# Altium schematic sheet LMS7002M Power.SchDoc
size E
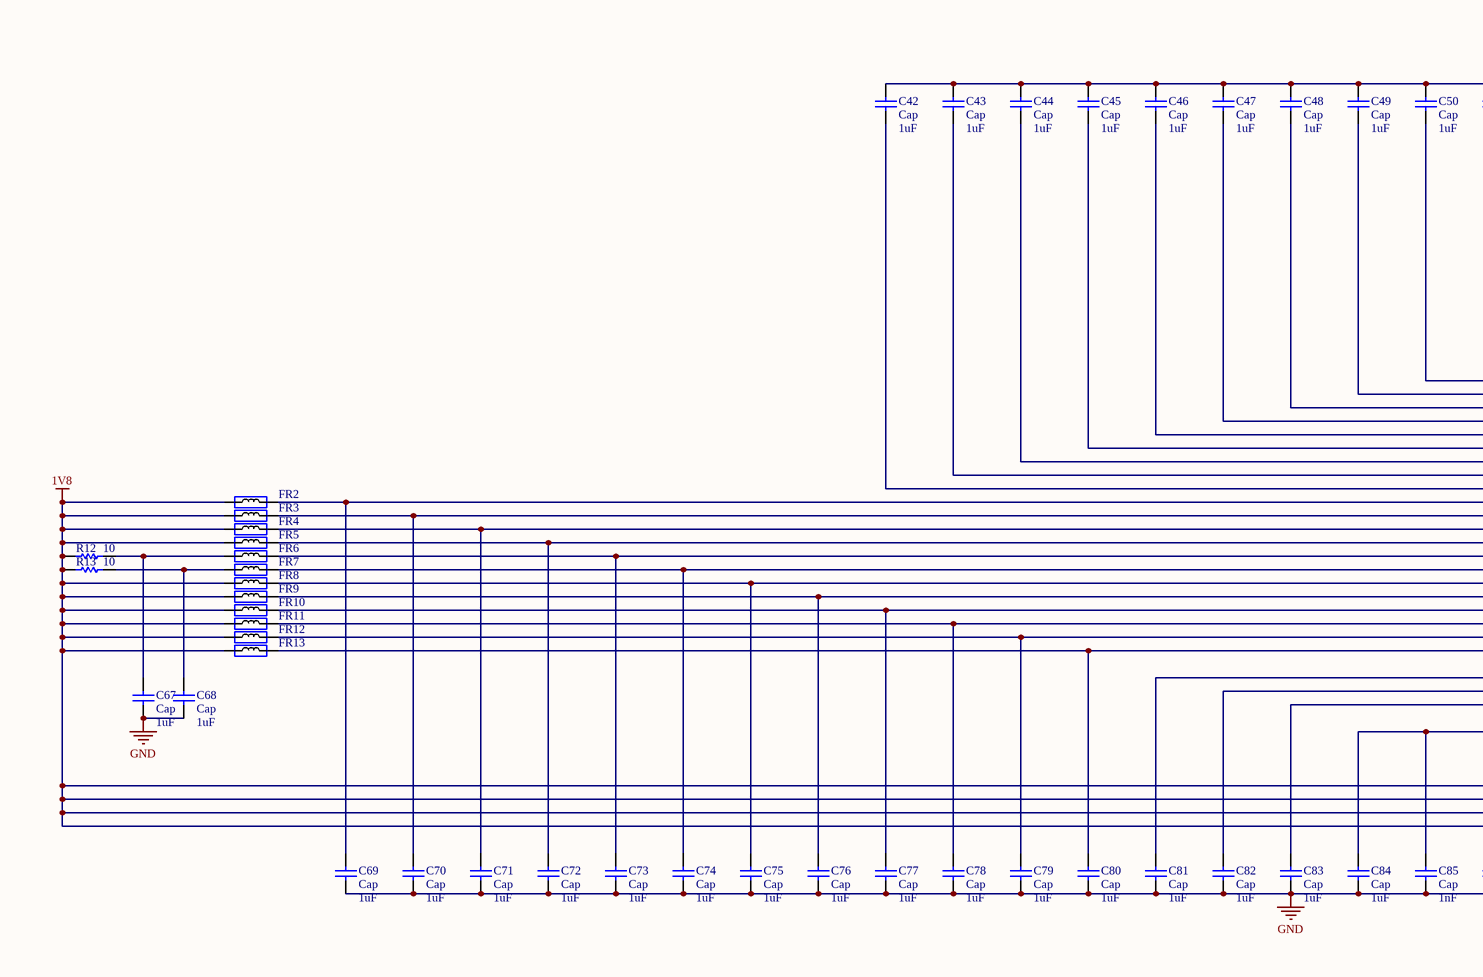
[diagram p0: LMS7002M Power.SchDoc, left]
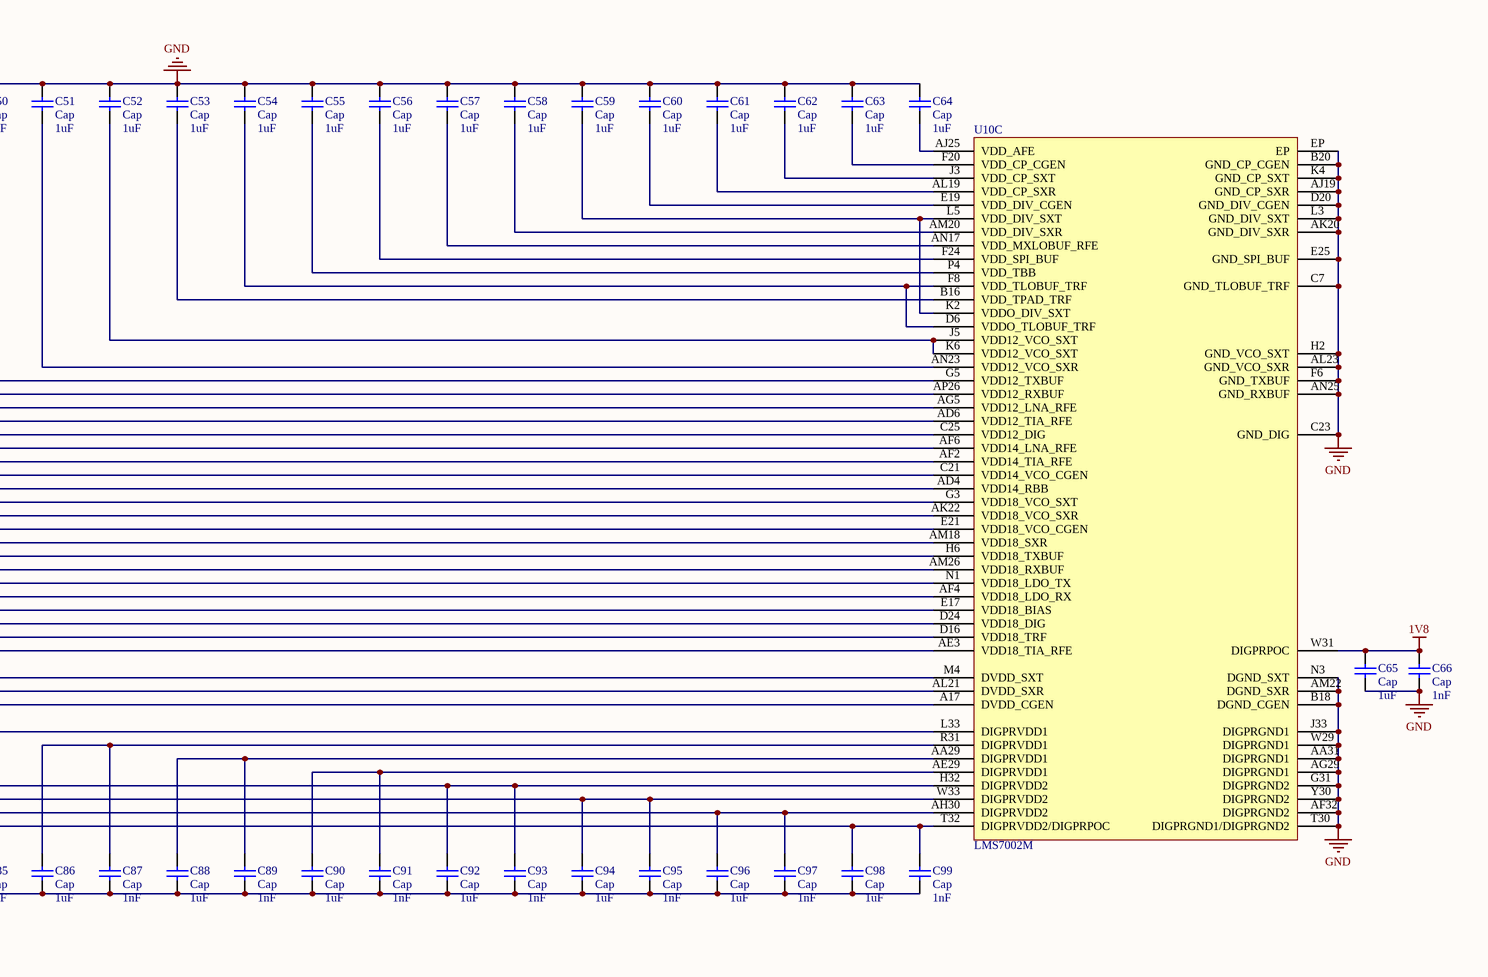
[diagram p1: LMS7002M Power.SchDoc, right]

## Parts
C42  Cap  value 1uF  [0603]
C43  Cap  value 1uF  [0603]
C44  Cap  value 1uF  [0603]
C45  Cap  value 1uF  [0603]
C46  Cap  value 1uF  [0603]
C47  Cap  value 1uF  [0603]
C48  Cap  value 1uF  [0603]
C49  Cap  value 1uF  [0603]
C50  Cap  value 1uF  [0603]
C51  Cap  value 1uF  [0603]
C52  Cap  value 1uF  [0603]
C53  Cap  value 1uF  [0603]
C54  Cap  value 1uF  [0603]
C55  Cap  value 1uF  [0603]
C56  Cap  value 1uF  [0603]
C57  Cap  value 1uF  [0603]
C58  Cap  value 1uF  [0603]
C59  Cap  value 1uF  [0603]
C60  Cap  value 1uF  [0603]
C61  Cap  value 1uF  [0603]
C62  Cap  value 1uF  [0603]
C63  Cap  value 1uF  [0603]
C64  Cap  value 1uF  [0603]
C65  Cap  value 1uF  [0603]
C66  Cap  value 1nF  [0603]
C67  Cap  value 1uF  [0603]
C68  Cap  value 1uF  [0603]
C69  Cap  value 1uF  [0603]
C70  Cap  value 1uF  [0603]
C71  Cap  value 1uF  [0603]
C72  Cap  value 1uF  [0603]
C73  Cap  value 1uF  [0603]
C74  Cap  value 1uF  [0603]
C75  Cap  value 1uF  [0603]
C76  Cap  value 1uF  [0603]
C77  Cap  value 1uF  [0603]
C78  Cap  value 1uF  [0603]
C79  Cap  value 1uF  [0603]
C80  Cap  value 1uF  [0603]
C81  Cap  value 1uF  [0603]
C82  Cap  value 1uF  [0603]
C83  Cap  value 1uF  [0603]
C84  Cap  value 1uF  [0603]
C85  Cap  value 1nF  [0603]
C86  Cap  value 1uF  [0603]
C87  Cap  value 1nF  [0603]
C88  Cap  value 1uF  [0603]
C89  Cap  value 1nF  [0603]
C90  Cap  value 1uF  [0603]
C91  Cap  value 1nF  [0603]
C92  Cap  value 1uF  [0603]
C93  Cap  value 1nF  [0603]
C94  Cap  value 1uF  [0603]
C95  Cap  value 1nF  [0603]
C96  Cap  value 1uF  [0603]
C97  Cap  value 1nF  [0603]
C98  Cap  value 1uF  [0603]
C99  Cap  value 1nF  [0603]
FR2  600R, 0.27A  [0603]  (value not drawn)
FR3  600R, 0.27A  [0603]  (value not drawn)
FR4  600R, 0.27A  [0603]  (value not drawn)
FR5  600R, 0.27A  [0603]  (value not drawn)
FR6  600R, 0.27A  [0603]  (value not drawn)
FR7  600R, 0.27A  [0603]  (value not drawn)
FR8  600R, 0.27A  [0603]  (value not drawn)
FR9  600R, 0.27A  [0603]  (value not drawn)
FR10  600R, 0.27A  [0603]  (value not drawn)
FR11  600R, 0.27A  [0603]  (value not drawn)
FR12  600R, 0.27A  [0603]  (value not drawn)
FR13  600R, 0.27A  [0603]  (value not drawn)
R12  value 10  [0402-A]  (hidden comment: Res1)
R13  value 10  [0402-A]  (hidden comment: Res1)
U10  LMS7002M  [LM-QFN-261_V]  (part C of 4)

## Nets
1V8: C65.2 C66.2 C92.2 C93.2 C94.2 C95.2 C96.2 C97.2 C98.2 C99.2 FR2.1 FR3.1 FR4.1 FR5.1 FR8.1 FR9.1 FR10.1 FR11.1 FR12.1 FR13.1 R12.1 R13.1 U10.AH30(DIGPRVDD2) U10.H32(DIGPRVDD2) U10.T32(DIGPRVDD2/DIGPRPOC) U10.W31(DIGPRPOC) U10.W33(DIGPRVDD2)
GND: C42.2 C43.2 C44.2 C45.2 C46.2 C47.2 C48.2 C49.2 C50.2 C51.2 C52.2 C53.2 C54.2 C55.2 C56.2 C57.2 C58.2 C59.2 C60.2 C61.2 C62.2 C63.2 C64.2 C65.1 C66.1 C67.1 C68.1 C69.1 C70.1 C71.1 C72.1 C73.1 C74.1 C75.1 C76.1 C77.1 C78.1 C79.1 C80.1 C81.1 C82.1 C83.1 C84.1 C85.1 C86.1 C87.1 C88.1 C89.1 C90.1 C91.1 C92.1 C93.1 C94.1 C95.1 C96.1 C97.1 C98.1 C99.1 U10.AA31(DIGPRGND1) U10.AF32(DIGPRGND2) U10.AG29(DIGPRGND1) U10.AJ19(GND_CP_SXR) U10.AK20(GND_DIV_SXR) U10.AL23(GND_VCO_SXR) U10.AM22(DGND_SXR) U10.AN25(GND_RXBUF) U10.B18(DGND_CGEN) U10.B20(GND_CP_CGEN) U10.C7(GND_TLOBUF_TRF) U10.C23(GND_DIG) U10.D20(GND_DIV_CGEN) U10.E25(GND_SPI_BUF) U10.EP U10.F6(GND_TXBUF) U10.G31(DIGPRGND2) U10.H2(GND_VCO_SXT) U10.J33(DIGPRGND1) U10.K4(GND_CP_SXT) U10.L3(GND_DIV_SXT) U10.N3(DGND_SXT) U10.T30(DIGPRGND1/DIGPRGND2) U10.W29(DIGPRGND1) U10.Y30(DIGPRGND2)
NetC42_1: C42.1 U10.AD4(VDD14_RBB)
NetC43_1: C43.1 U10.C21(VDD14_VCO_CGEN)
NetC44_1: C44.1 U10.AF2(VDD14_TIA_RFE)
NetC45_1: C45.1 U10.AF6(VDD14_LNA_RFE)
NetC46_1: C46.1 U10.C25(VDD12_DIG)
NetC47_1: C47.1 U10.AD6(VDD12_TIA_RFE)
NetC48_1: C48.1 U10.AG5(VDD12_LNA_RFE)
NetC49_1: C49.1 U10.AP26(VDD12_RXBUF)
NetC50_1: C50.1 U10.G5(VDD12_TXBUF)
NetC51_1: C51.1 U10.AN23(VDD12_VCO_SXR)
NetC52_1: C52.1 U10.J5(VDD12_VCO_SXT) U10.K6(VDD12_VCO_SXT)
NetC53_1: C53.1 U10.B16(VDD_TPAD_TRF)
NetC54_1: C54.1 U10.D6(VDDO_TLOBUF_TRF) U10.F8(VDD_TLOBUF_TRF)
NetC55_1: C55.1 U10.P4(VDD_TBB)
NetC56_1: C56.1 U10.F24(VDD_SPI_BUF)
NetC57_1: C57.1 U10.AN17(VDD_MXLOBUF_RFE)
NetC58_1: C58.1 U10.AM20(VDD_DIV_SXR)
NetC59_1: C59.1 U10.K2(VDDO_DIV_SXT) U10.L5(VDD_DIV_SXT)
NetC60_1: C60.1 U10.E19(VDD_DIV_CGEN)
NetC61_1: C61.1 U10.AL19(VDD_CP_SXR)
NetC62_1: C62.1 U10.J3(VDD_CP_SXT)
NetC63_1: C63.1 U10.F20(VDD_CP_CGEN)
NetC64_1: C64.1 U10.AJ25(VDD_AFE)
NetC67_2: C67.2 FR6.1 R12.2
NetC68_2: C68.2 FR7.1 R13.2
NetC69_2: C69.2 FR2.2 U10.G3(VDD18_VCO_SXT)
NetC70_2: C70.2 FR3.2 U10.AK22(VDD18_VCO_SXR)
NetC71_2: C71.2 FR4.2 U10.E21(VDD18_VCO_CGEN)
NetC72_2: C72.2 FR5.2 U10.AM18(VDD18_SXR)
NetC73_2: C73.2 FR6.2 U10.H6(VDD18_TXBUF)
NetC74_2: C74.2 FR7.2 U10.AM26(VDD18_RXBUF)
NetC75_2: C75.2 FR8.2 U10.N1(VDD18_LDO_TX)
NetC76_2: C76.2 FR9.2 U10.AF4(VDD18_LDO_RX)
NetC77_2: C77.2 FR10.2 U10.E17(VDD18_BIAS)
NetC78_2: C78.2 FR11.2 U10.D24(VDD18_DIG)
NetC79_2: C79.2 FR12.2 U10.D16(VDD18_TRF)
NetC80_2: C80.2 FR13.2 U10.AE3(VDD18_TIA_RFE)
NetC81_2: C81.2 U10.M4(DVDD_SXT)
NetC82_2: C82.2 U10.AL21(DVDD_SXR)
NetC83_2: C83.2 U10.A17(DVDD_CGEN)
NetC84_2: C84.2 C85.2 U10.L33(DIGPRVDD1)
NetC86_2: C86.2 C87.2 U10.R31(DIGPRVDD1)
NetC88_2: C88.2 C89.2 U10.AA29(DIGPRVDD1)
NetC90_2: C90.2 C91.2 U10.AE29(DIGPRVDD1)

## Library data of the parts
C42-C99 = Cap: Capacitor; Published: 8-Jun-2000; LatestRevisionDate: 17-Jul-2002; LatestRevisionNote: Re-released for DXP Platform.; PackageReference: RAD-0.3; Publisher: Altium Limited; PackageDescription: Radial Cap, Thru-Hole; 2 Leads; 0.3 in Pin Spacing
FR2-FR13 = Ferrite: Manufacturer Part Number 1: BK0603TS601-T; Manufacturer: Taiyo Yuden; Part Description: FERRITE BEAD 600 OHM 0201 1LN; DC Resistance (DCR): 750 mOhm Max; Filter Type: Differential Mode - Single; Impedance @ Frequency: 600 Ohm @ 100MHz; Current Rating: 270mA; Value: 600R@100MHz; Size / Dimension: 0.024" L x 0.012" W (0.60mm x 0.30mm); Package / Case: 0201 (0603 Metric); Height (Max): 0.013" (0.33mm); Mounting Type: Surface Mount; Packaging: Cut Tape (CT); RoHS: RoHS Compliant; Category: Filters; Supplier 1: Digi-Key
R12 R13 = Res1: Resistor; Published: 8-Jun-2000; LatestRevisionDate: 17-Jul-2002; LatestRevisionNote: Re-released for DXP Platform.; PackageReference: AXIAL-0.3; Publisher: Altium Limited; PackageDescription: Axial Device, Thru-Hole; 2 Leads; 0.3 in Pin Spacing
U10 = CMP-2000-06561-1: FPRF MIMO Transceiver IC with Integrated Microcontroller, 1.1 to 1.89 V, -40 to 85 degC, 261-Pin QFN, RoHS; Manufacturer: LimeMicrosystemsLtd; Current - Receiving: 420mA; Protocol: CDMA,GSM,HSPA,LTE,TD-SCDMA,WCDMA; Frequency: 100kHz~3.8GHz; Current - Transmitting: 350mA; Memory Size: 10kBSRAM; Power - Output: 0dBm; Serial Interfaces: SPI; RF Family/Standard: Cellular; Voltage - Supply: 1.1V~1.89V; GPIO: -; Data Rate (Max): -; Family: RFTransceiverICs; Modulation: -; Mounting Technology: SurfaceMount; Datasheet URL: http://www.richardsonrfpd.com/resources/RellDocuments/SYS_31/LMS7002M.pdf; Package Description: 261-Pin Quad Flat No-lead Package, Body 11.5 x 11.5 mm, Pitch 0.666 mm; Series: -; Sensitivity: -; Category: RF/IFandRFID; Package Reference: QFN-261; Package / Case: 261-SMDModule; Package URL: http://cdn.limemicro.com/wp-content/uploads/2015/08/LMS7002M-PCB-Layout-Recommendations-1.0r5.pdf; Operating Temperature: -40°C~85°C; Manufacturer URL: http://www.limemicro.com/; Packaging: Tray; Datasheet Version: Rev. 2.8.0, 09/2015; Type: TxRx+MCU